# EAGLE design LineMixer  v1.1 (EAGLE 9.1.3)
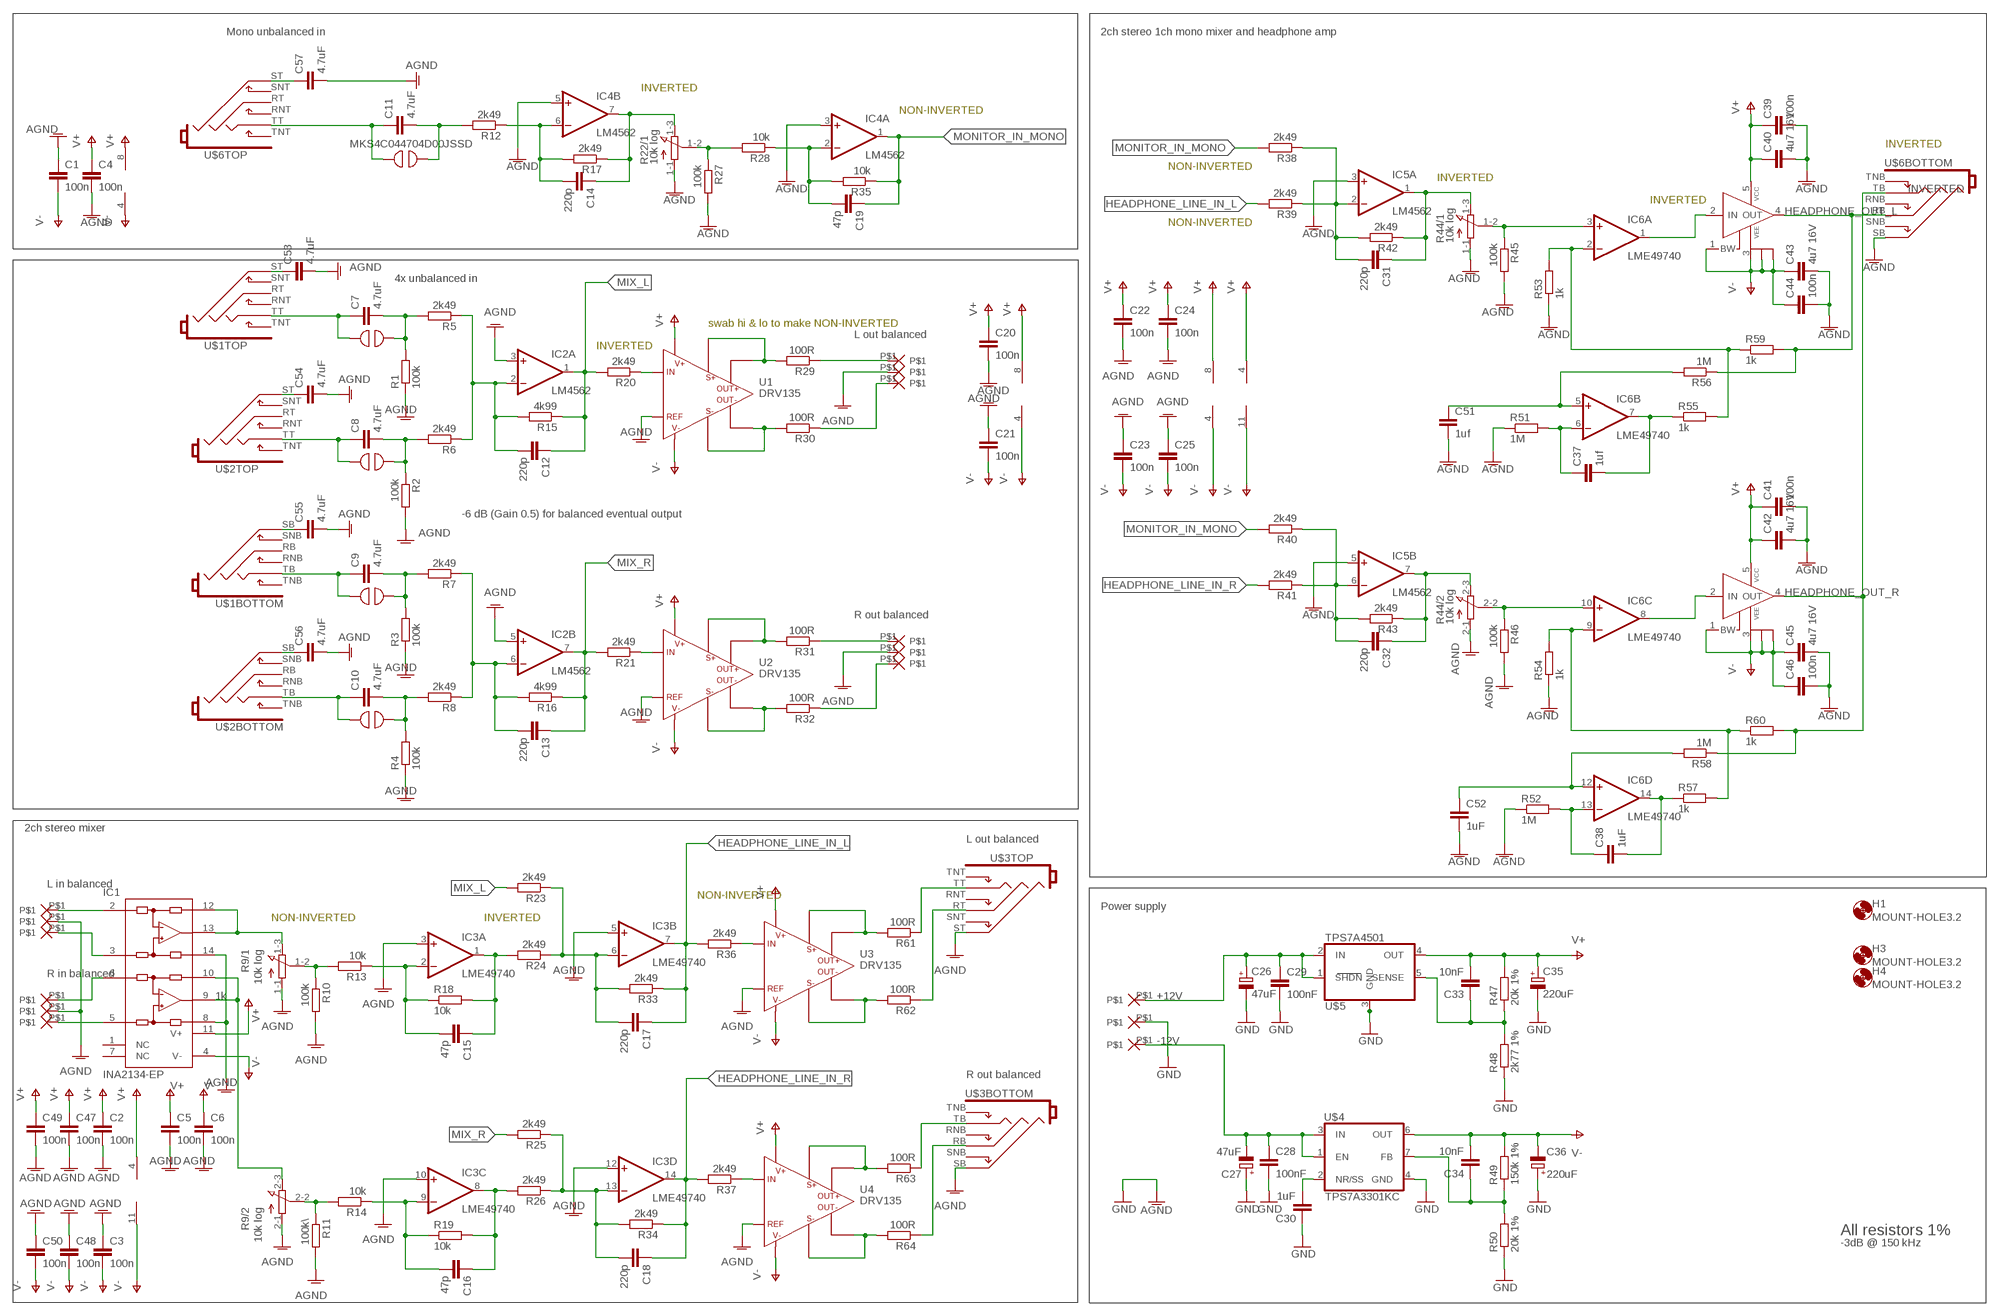
[diagram p0: schematic, sheet 1]

## Parts
C1  100n  C-EUC0603  [C0603]
C2  100n  C-EUC0603  [C0603]
C3  100n  C-EUC0603  [C0603]
C4  100n  C-EUC0603  [C0603]
C5  100n  C-EUC0603  [C0603]
C6  100n  C-EUC0603  [C0603]
C7  4.7uF  C15/7  [C15B7]
C8  4.7uF  C15/7  [C15B7]
C9  4.7uF  C15/7  [C15B7]
C10  4.7uF  C15/7  [C15B7]
C11  4.7uF  C15/7  [C15B7]
C12  220p  C-EUC0603K  [C0603K]
C13  220p  C-EUC0603K  [C0603K]
C14  220p  C-EUC0603K  [C0603K]
C15  47p  C-EUC0603K  [C0603K]
C16  47p  C-EUC0603K  [C0603K]
C17  220p  C-EUC0603K  [C0603K]
C18  220p  C-EUC0603K  [C0603K]
C19  47p  C-EUC0603K  [C0603K]
C20  100n  C-EUC0603  [C0603]
C21  100n  C-EUC0603  [C0603]
C22  100n  C-EUC0603  [C0603]
C23  100n  C-EUC0603  [C0603]
C24  100n  C-EUC0603  [C0603]
C25  100n  C-EUC0603  [C0603]
C26  47uF  CPOL-EUD/7343-31R  [D/7343-31R]
C27  47uF  CPOL-EUD/7343-31R  [D/7343-31R]
C28  100nF  C-EUC0603  [C0603]
C29  100nF  C-EUC0603  [C0603]
C30  1uF  C-EUC0603  [C0603]
C31  220p  C-EUC0603K  [C0603K]
C32  220p  C-EUC0603K  [C0603K]
C33  10nF  C-EUC0603  [C0603]
C34  10nF  C-EUC0603  [C0603]
C35  220uF  CPOL-EUD/7343-31R  [D/7343-31R]
C36  220uF  CPOL-EUD/7343-31R  [D/7343-31R]
C37  1uf  C-EUC0603  [C0603]
C38  1uF  C-EUC0603  [C0603]
C39  100n  C-EUC0603  [C0603]
C40  4u7 16V  C-EUC1206  [C1206]
C41  100n  C-EUC0603  [C0603]
C42  4u7 16V  C-EUC1206  [C1206]
C43  4u7 16V  C-EUC1206  [C1206]
C44  100n  C-EUC0603  [C0603]
C45  4u7 16V  C-EUC1206  [C1206]
C46  100n  C-EUC0603  [C0603]
C47  100n  C-EUC0603  [C0603]
C48  100n  C-EUC0603  [C0603]
C49  100n  C-EUC0603  [C0603]
C50  100n  C-EUC0603  [C0603]
C51  1uf  C-EUC0603  [C0603]
C52  1uF  C-EUC0603  [C0603]
C53  4.7uF  C15/7  [C15B7]
C54  4.7uF  C15/7  [C15B7]
C55  4.7uF  C15/7  [C15B7]
C56  4.7uF  C15/7  [C15B7]
C57  4.7uF  C15/7  [C15B7]
H1  MOUNT-HOLE3.2  [3,2]
H3  MOUNT-HOLE3.2  [3,2]
H4  MOUNT-HOLE3.2  [3,2]
IC1  INA2134-EP  INA2134U  [SO14]
IC2  LM4562  LM4558D  [SO08]
IC3  LME49740  TL074D  [SO14]
IC4  LM4562  LM4558D  [SO08]
IC5  LM4562  LM4558D  [SO08]
IC6  LME49740  TL074D  [SO14]
IC7  LME49600  [TS5B]
IC8  LME49600  [TS5B]
R1  100k  R-EU_0207/7  [0207/7]
R2  100k  R-EU_0207/7  [0207/7]
R3  100k  R-EU_0207/7  [0207/7]
R4  100k  R-EU_0207/7  [0207/7]
R5  2k49  R-EU_0207/7  [0207/7]
R6  2k49  R-EU_0207/7  [0207/7]
R7  2k49  R-EU_0207/7  [0207/7]
R8  2k49  R-EU_0207/7  [0207/7]
R9  10k log  3RP/1610G  [3RP/1610G]
R10  100k  R-EU_0207/7  [0207/7]
R11  100k\  R-EU_0207/7  [0207/7]
R12  2k49  R-EU_0207/7  [0207/7]
R13  10k  R-EU_0207/7  [0207/7]
R14  10k  R-EU_0207/7  [0207/7]
R15  4k99  R-EU_0207/7  [0207/7]
R16  4k99  R-EU_0207/7  [0207/7]
R17  2k49  R-EU_0207/7  [0207/7]
R18  10k  R-EU_0207/7  [0207/7]
R19  10k  R-EU_0207/7  [0207/7]
R20  2k49  R-EU_0207/7  [0207/7]
R21  2k49  R-EU_0207/7  [0207/7]
R22  10k log  3RP/1610G  [3RP/1610G]
R23  2k49  R-EU_0207/7  [0207/7]
R24  2k49  R-EU_0207/7  [0207/7]
R25  2k49  R-EU_0207/7  [0207/7]
R26  2k49  R-EU_0207/7  [0207/7]
R27  100k  R-EU_0207/7  [0207/7]
R28  10k  R-EU_0207/7  [0207/7]
R29  100R  R-EU_0207/7  [0207/7]
R30  100R  R-EU_0207/7  [0207/7]
R31  100R  R-EU_0207/7  [0207/7]
R32  100R  R-EU_0207/7  [0207/7]
R33  2k49  R-EU_0207/7  [0207/7]
R34  2k49  R-EU_0207/7  [0207/7]
R35  10k  R-EU_0207/7  [0207/7]
R36  2k49  R-EU_0207/7  [0207/7]
R37  2k49  R-EU_0207/7  [0207/7]
R38  2k49  R-EU_0207/7  [0207/7]
R39  2k49  R-EU_0207/7  [0207/7]
R40  2k49  R-EU_0207/7  [0207/7]
R41  2k49  R-EU_0207/7  [0207/7]
R42  2k49  R-EU_0207/7  [0207/7]
R43  2k49  R-EU_0207/7  [0207/7]
R44  10k log  3RP/1610G  [3RP/1610G]
R45  100k  R-EU_0207/7  [0207/7]
R46  100k  R-EU_0207/7  [0207/7]
R47  20k 1%  R-EU_R0603  [R0603]
R48  2k77 1%  R-EU_R0603  [R0603]
R49  150k 1%  R-EU_R0603  [R0603]
R50  20k 1%  R-EU_R0603  [R0603]
R51  1M  R-EU_0207/7  [0207/7]
R52  1M  R-EU_0207/7  [0207/7]
R53  1k  R-EU_0207/7  [0207/7]
R54  1k  R-EU_0207/7  [0207/7]
R55  1k  R-EU_0207/7  [0207/7]
R56  1M  R-EU_0207/7  [0207/7]
R57  1k  R-EU_0207/7  [0207/7]
R58  1M  R-EU_0207/7  [0207/7]
R59  1k  R-EU_0207/7  [0207/7]
R60  1k  R-EU_0207/7  [0207/7]
R61  100R  R-EU_0207/7  [0207/7]
R62  100R  R-EU_0207/7  [0207/7]
R63  100R  R-EU_0207/7  [0207/7]
R64  100R  R-EU_0207/7  [0207/7]
S1  SOLDERLINK  [SOLDERLINK]
S2  SOLDERLINK  [SOLDERLINK]
S3  SOLDERLINK  [SOLDERLINK]
S4  SOLDERLINK  [SOLDERLINK]
S5  SOLDERLINK  [SOLDERLINK]
U1  DRV135  DRV134SO-8  [SO-8]
U2  DRV135  DRV134SO-8  [SO-8]
U3  DRV135  DRV134SO-8  [SO-8]
U4  DRV135  DRV134SO-8  [SO-8]
U$1  NSJ12HF-1  [NSJ12HF-1]
U$2  NSJ12HF-1  [NSJ12HF-1]
U$3  NSJ12HF-1  [NSJ12HF-1]
U$4  TPS7A3301KC  [TO220-7]
U$5  TPS7A4501  [SOT223-5]
U$6  NSJ12HF-1  [NSJ12HF-1]
U$7  PAD1.5MM  [PAD_1.5MM]
U$8  PAD1.5MM  [PAD_1.5MM]
U$10  PAD1.5MM  [PAD_1.5MM]
U$11  PAD1.5MM  [PAD_1.5MM]
U$12  PAD1.5MM  [PAD_1.5MM]
U$13  PAD1.5MM  [PAD_1.5MM]
U$14  PAD1.5MM  [PAD_1.5MM]
U$15  PAD1.5MM  [PAD_1.5MM]
U$16  PAD1.5MM  [PAD_1.5MM]
U$17  PAD1.5MM  [PAD_1.5MM]
U$18  PAD1.5MM  [PAD_1.5MM]
U$19  PAD1.5MM  [PAD_1.5MM]
U$20  PAD1.5MM  [PAD_1.5MM]
U$21  PAD1.5MM  [PAD_1.5MM]
U$22  PAD1.5MM  [PAD_1.5MM]

## Nets
+12V: C26.+ C29.1 U$5.1(SHDN) U$5.2(IN) U$20.P$1
-12V: C27.- C28.1 U$4.1(EN) U$4.3(IN) U$22.P$1
AGND: C1.1 C2.2 C3.1 C4.2 C5.2 C6.2 C20.2 C21.1 C22.2 C23.1 C24.2 C25.1 C26.- C27.+ C28.2 C29.2 C30.1 C35.- C36.+ C39.2 C40.2 C41.2 C42.2 C43.2 C44.2 C45.2 C46.2 C47.2 C48.1 C49.2 C50.1 C51.2 C52.2 C53.2 C54.2 C55.2 C56.2 C57.2 IC1.8(REFB) IC1.14(REFA) IC2.3(A:+IN) IC2.5(B:+IN) IC3.3(A:+IN) IC3.5(B:+IN) IC3.10(C:+IN) IC3.12(D:+IN) IC4.3(A:+IN) IC4.5(B:+IN) IC5.3(A:+IN) IC5.5(B:+IN) R1.1 R2.2 R3.1 R4.1 R9.1-1(/1:A) R9.2-1(/2:A) R10.2 R11.2 R22.1-1(/1:A) R27.2 R44.1-1(/1:A) R44.2-1(/2:A) R45.2 R46.2 R48.1 R50.1 R51.1 R52.1 R53.1 R54.1 U1.P3(REF) U2.P3(REF) U3.P3(REF) U4.P3(REF) U$3.SB(BOTTOM:S) U$3.ST(TOP:S) U$4.4(GND) U$5.3(GND) U$5.TAB(GND) U$6.SB(BOTTOM:S) U$8.P$1 U$12.P$1 U$15.P$1 U$18.P$1 U$21.P$1 ; supply symbol labelled GND
HEADPHONE_LINE_IN_L: C17.1 IC3.7(B:OUT) R33.1 R36.2 R39.2
HEADPHONE_LINE_IN_R: C18.1 IC3.14(D:OUT) R34.1 R37.2 R41.2
HEADPHONE_OUT_L: IC7.4(OUT) R56.1 R59.2 U$6.RB(BOTTOM:R)
HEADPHONE_OUT_R: IC8.4(OUT) R58.1 R60.2 U$6.TB(BOTTOM:T)
MIX_L: C12.1 IC2.1(A:OUT) R15.1 R20.2 R23.2
MIX_R: C13.1 IC2.7(B:OUT) R16.1 R21.2 R25.2
MONITOR_IN_MONO: C19.1 IC4.1(A:OUT) R35.1 R38.2 R40.2
MONITOR_IN_MONO1: C14.1 IC4.7(B:OUT) R17.1 R22.1-3(/1:E)
N$1: R63.2 U4.P7(SENSE+) U4.P8(OUT+)
N$2: IC1.3(+INA) U$10.P$1
N$3: C9.2 R3.2 R7.2 S3.P$1
N$4: R61.2 U3.P7(SENSE+) U3.P8(OUT+)
N$5: C7.2 R1.2 R5.2 S1.P$1
N$6: C8.2 R2.1 R6.2 S2.P$1
N$7: C32.1 IC5.7(B:OUT) R43.1 R44.2-3(/2:E)
N$8: C15.2 IC3.2(A:-IN) R13.1 R18.1
N$9: C10.2 R4.2 R8.2 S4.P$1
N$10: IC1.12(SENSEA) IC1.13(OUTA) R9.1-3(/1:E)
N$11: R36.1 U3.P4(IN)
N$12: IC1.2(-INA) U$7.P$1
N$13: C32.2 IC5.6(B:-IN) R40.1 R41.1 R43.2
N$14: C16.2 IC3.9(C:-IN) R14.1 R19.1
N$15: R37.1 U4.P4(IN)
N$16: IC1.6(-INB) U$11.P$1
N$17: R62.1 U$3.RT(TOP:R)
N$18: IC1.5(+INB) U$13.P$1
N$19: R64.1 U$3.RB(BOTTOM:R)
N$20: IC1.9(OUTB) IC1.10(SENSEB) R9.2-3(/2:E)
N$21: C11.1 S5.P$2 U$6.TT(TOP:T)
N$22: C34.1 R49.1 R50.2 U$4.7(FB)
N$23: IC6.10(C:+IN) R44.2-2(/2:S) R46.1
N$24: C12.2 IC2.2(A:-IN) R5.1 R6.1 R15.2
N$25: R29.2 U1.P7(SENSE+) U1.P8(OUT+)
N$26: C15.1 IC3.1(A:OUT) R18.2 R24.2
N$27: C14.2 IC4.6(B:-IN) R12.1 R17.2
N$28: R20.1 U1.P4(IN)
N$29: C11.2 R12.2 S5.P$1
N$30: C18.2 IC3.13(D:-IN) R25.1 R26.1 R34.2
N$31: R30.1 U$19.P$1
N$32: R29.1 U$17.P$1
N$33: C31.1 IC5.1(A:OUT) R42.1 R44.1-3(/1:E)
N$34: R30.2 U1.P1(OUT-) U1.P2(SENSE-)
N$35: R21.1 U2.P4(IN)
N$36: C13.2 IC2.6(B:-IN) R7.1 R8.1 R16.2
N$37: C17.2 IC3.6(B:-IN) R23.1 R24.1 R33.2
N$38: R31.1 U$14.P$1
N$39: C31.2 IC5.2(A:-IN) R38.1 R39.1 R42.2
N$40: R32.1 U$16.P$1
N$41: R32.2 U2.P1(OUT-) U2.P2(SENSE-)
N$42: R31.2 U2.P7(SENSE+) U2.P8(OUT+)
N$43: IC6.3(A:+IN) R44.1-2(/1:S) R45.1
N$44: C16.1 IC3.8(C:OUT) R19.2 R26.2
N$45: IC6.2(A:-IN) R53.2 R55.2 R59.1
N$46: R61.1 U$3.TT(TOP:T)
N$47: R62.2 U3.P1(OUT-) U3.P2(SENSE-)
N$48: IC6.1(A:OUT) IC7.2(IN)
N$49: C37.1 IC6.6(B:-IN) R51.2
N$50: C37.2 IC6.7(B:OUT) R55.1
N$51: C51.1 IC6.5(B:+IN) R56.2
N$52: IC6.9(C:-IN) R54.2 R57.2 R60.1
N$53: IC6.8(C:OUT) IC8.2(IN)
N$54: R9.1-2(/1:S) R10.1 R13.2
N$55: C38.2 IC6.14(D:OUT) R57.1
N$56: C38.1 IC6.13(D:-IN) R52.2
N$57: R9.2-2(/2:S) R11.1 R14.2
N$58: C52.1 IC6.12(D:+IN) R58.2
N$59: C19.2 IC4.2(A:-IN) R28.1 R35.2
N$60: R22.1-2(/1:S) R27.1 R28.2
N$61: R63.1 U$3.TB(BOTTOM:T)
N$62: C30.2 U$4.2(NR/SS)
N$63: R64.2 U4.P1(OUT-) U4.P2(SENSE-)
N$64: C7.1 S1.P$2 U$1.TT(TOP:T)
N$65: C8.1 S2.P$2 U$2.TT(TOP:T)
N$66: C53.1 U$1.ST(TOP:S)
N$67: C57.1 U$6.ST(TOP:S)
N$68: C54.1 U$2.ST(TOP:S)
N$69: C9.1 S3.P$2 U$1.TB(BOTTOM:T)
N$70: C10.1 S4.P$2 U$2.TB(BOTTOM:T)
N$71: C55.1 U$1.SB(BOTTOM:S)
N$72: C56.1 U$2.SB(BOTTOM:S)
N$74: C33.1 R47.1 R48.2 U$5.5(SENSE)
V+: C2.1 C4.1 C5.1 C20.1 C22.1 C24.1 C33.2 C35.+ C39.1 C40.1 C41.1 C42.1 C47.1 C49.1 IC1.11(V+) IC2.8(P:V+) IC3.4(P:V+) IC4.8(P:V+) IC5.8(P:V+) IC6.4(P:V+) IC7.5(VCC) IC8.5(VCC) R47.2 U1.P6(V+) U2.P6(V+) U3.P6(V+) U4.P6(V+) U$5.4(OUT)
V-: C1.2 C3.2 C6.1 C21.2 C23.2 C25.2 C34.2 C36.- C43.1 C44.1 C45.1 C46.1 C48.2 C50.2 IC1.4(V-) IC2.4(P:V-) IC3.11(P:V-) IC4.4(P:V-) IC5.4(P:V-) IC6.11(P:V-) IC7.1(BW) IC7.3(VEE) IC7.TH@1(VEE) IC7.TH@2(VEE) IC8.1(BW) IC8.3(VEE) IC8.TH@1(VEE) IC8.TH@2(VEE) R49.2 U1.P5(V-) U2.P5(V-) U3.P5(V-) U4.P5(V-) U$4.6(OUT)
Unconnected: IC1.1(NC) IC1.7(NC) R22.2-1(/2:A) R22.2-2(/2:S) R22.2-3(/2:E) U$1.RB(BOTTOM:R) U$1.RNB(BOTTOM:RN) U$1.RNT(TOP:RN) U$1.RT(TOP:R) U$1.SNB(BOTTOM:SN) U$1.SNT(TOP:SN) U$1.TNB(BOTTOM:TN) U$1.TNT(TOP:TN) U$2.RB(BOTTOM:R) U$2.RNB(BOTTOM:RN) U$2.RNT(TOP:RN) U$2.RT(TOP:R) U$2.SNB(BOTTOM:SN) U$2.SNT(TOP:SN) U$2.TNB(BOTTOM:TN) U$2.TNT(TOP:TN) U$3.RNB(BOTTOM:RN) U$3.RNT(TOP:RN) U$3.SNB(BOTTOM:SN) U$3.SNT(TOP:SN) U$3.TNB(BOTTOM:TN) U$3.TNT(TOP:TN) U$6.RNB(BOTTOM:RN) U$6.RNT(TOP:RN) U$6.RT(TOP:R) U$6.SNB(BOTTOM:SN) U$6.SNT(TOP:SN) U$6.TNB(BOTTOM:TN) U$6.TNT(TOP:TN)

## Notes on the sheet
- Mono unbalanced in | 2ch stereo 1ch mono mixer and headphone amp
- INVERTED
- NON-INVERTED
- MKS4C044704D00JSSD | INVERTED
- NON-INVERTED
- INVERTED
- INVERTED
- INVERTED
- NON-INVERTED
- 4x unbalanced in
- swab hi & lo to make NON-INVERTED
- L out balanced
- INVERTED
- -6 dB (Gain 0.5) for balanced eventual output
- R out balanced
- 2ch stereo mixer
- L out balanced
- L in balanced
- NON-INVERTED
- Power supply
- NON-INVERTED | INVERTED
- R in balanced
- 1k
- R out balanced
- All resistors 1%
- -3dB @ 150 kHz

## Library data of the parts
C1-C6 C12-C25 C28-C34 C37-C52 = rcl:C-EU: CAPACITOR, European symbol
C7-C11 C53-C57 = capacitor-wima:C: CAPACITOR naming: grid - package width
C26 C27 C35 C36 = rcl:CPOL-EU: POLARIZED CAPACITOR, European symbol
H1 H3 H4 = holes:MOUNT-HOLE: MOUNTING HOLE with drill center marker
IC1 = burr-brown:INA2134: Audio Differential Line Receivers 0dB, G=1; MF: TEXAS INSTRUMENTS; MPN: INA2134UA; OC_FARNELL: 1212422; OC_NEWARK: 35C1748
IC2 IC4 IC5 = linear:*4558: OP AMP
IC3 IC6 = linear:TL074: OP AMP
IC7 IC8 = national-semiconductor:LME49600: High Performance, High Fidelity, High Current Audio Buffer Source: Data sheet <http://www.national.com/ds/LM/LME49600.pdf>
R1-R8 R10-R21 R23-R43 R45-R64 = rcl:R-EU_: RESISTOR, European symbol
R9 R22 R44 = pot:3RP/1610G: 16mm Potentiometer two level Source: http://www.alphapotentiometers.net/html/16mm_pot_2.html
S1-S5 = testpads:SOLDERLINK
U1-U4 = active:DRV134
U$1-U$3 U$6 = Neutrik:NSJ12HF-1: Stereo dual jack, full threaded nose The 1/4" stacking jack features highest board packing density as two jacks are in a single footprint and as they fit in 1 RU.
U$4 = TPS7A33:TPS7A33: Ultralow-Noise Negative Voltage Regulator v3
U$5 = TPS7A45xx:TPS7A4501: LOW-NOISE FAST-TRANSIENT-RESPONSE 1.5-A LOW-DROPOUT VOLTAGE REGULATOR
U$7 U$8 U$10-U$22 = PAD:PAD

## Board
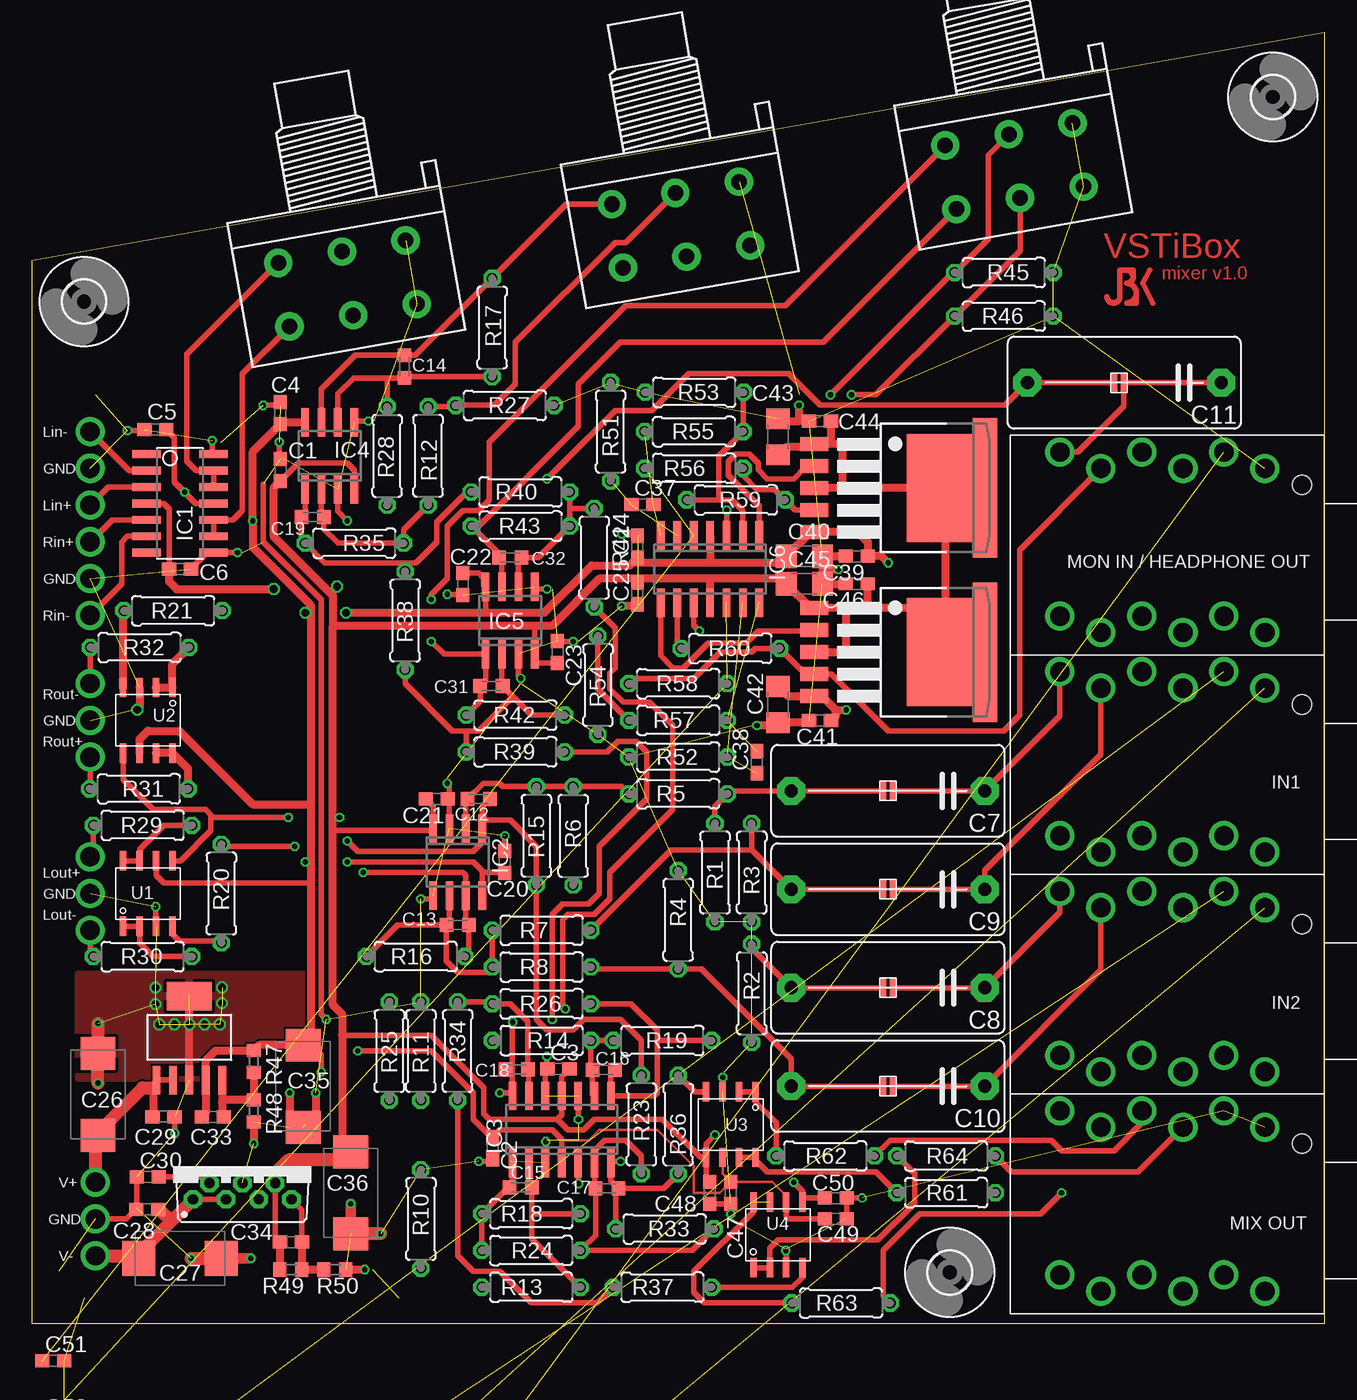
[diagram p1: board, top side]
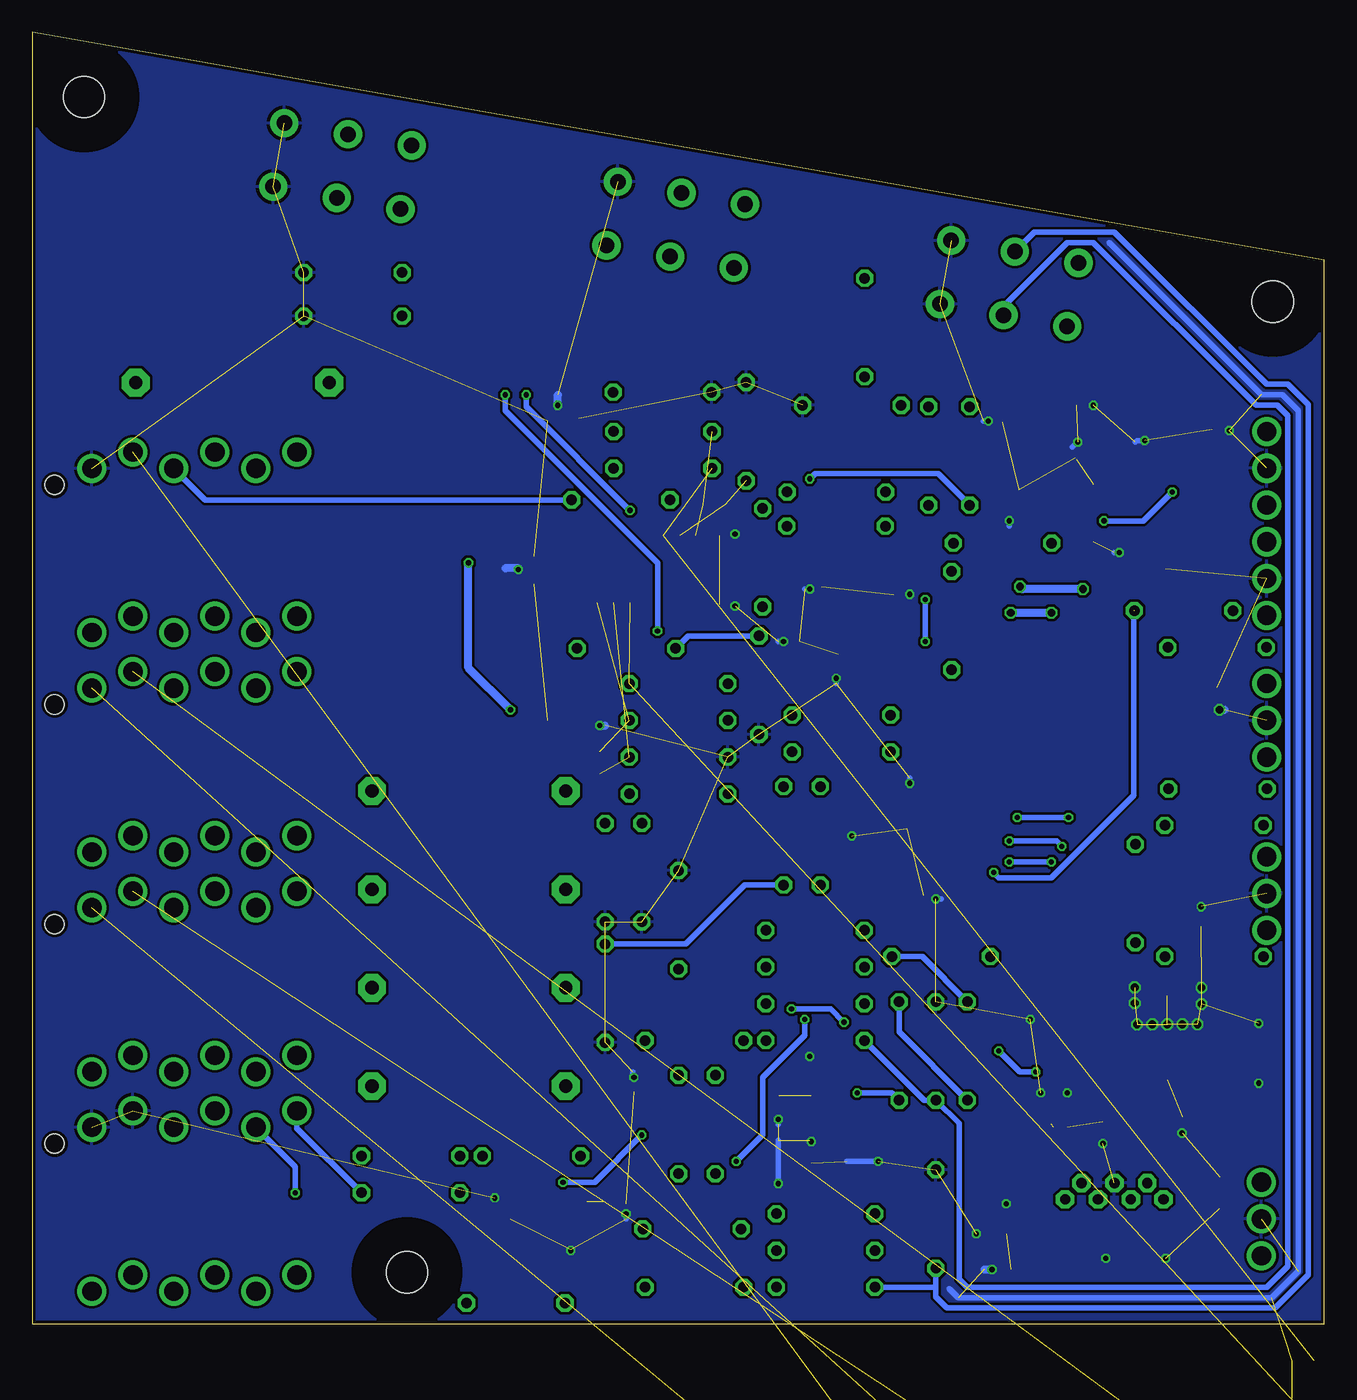
[diagram p2: board, bottom side, seen from below]

Size 100 x 100 mm. Coordinates in mm from the lower left corner, seen from the top.
Outline: 100,100 100,0 0,0 0,82.37 100,100
Copper layers (1*16): Top 0.035mm / dielectric 1.5mm / Bottom 0.035mm
Design rules "ITEADstudio_DRC *": minimum track width 6mil, minimum drill 12mil, track to track 6mil, track to pad 6mil, pad to pad 6mil, via to via 6mil, smd to smd 0mil, copper to edge 10mil, drill to drill 10mil, minimum pad ring 10mil, minimum via ring 6mil, stop-mask expansion 2mil, vias tented up to drill 100mil, thermal gap 10mil

### Footprints (pad centres in the part's own frame; a part is rotated, then mirrored left to right if it is on the bottom)
C0603 = smd 1.1 x 1: 1 -0.85,0; 2 0.85,0
C15B7 = drill 1.016 pad 2.159 octagon: 1 -7.493,0; 2 7.493,0
C0603K = smd 1.05 x 1.08: 1 -0.875,0; 2 0.875,0
D/7343-31R = smd 2.55 x 2.7: + 3.175,0; - -3.175,0
C1206 = smd 1.6 x 1.8: 1 -1.4,0; 2 1.4,0
3,2 = hole 3.2: 0,0
SO14 = smd 0.61 x 2.21: 1 -3.81,-2.603; 2 -2.54,-2.603; 3 -1.27,-2.603; 4 0,-2.603; 5 1.27,-2.603; 6 2.54,-2.603; 7 3.81,-2.603; 8 3.81,2.603; 9 2.54,2.603; 10 1.27,2.603; 11 0,2.603; 12 -1.27,2.603; 13 -2.54,2.603; 14 -3.81,2.603
SO08 = smd 0.6 x 2.2: 1 -1.905,-2.6; 2 -0.635,-2.6; 3 0.635,-2.6; 4 1.905,-2.6; 5 1.905,2.6; 6 0.635,2.6; 7 -0.635,2.6; 8 -1.905,2.6
SO14' = smd 0.6 x 2.2: 1 -3.81,-2.6; 2 -2.54,-2.6; 3 -1.27,-2.6; 4 0,-2.6; 5 1.27,-2.6; 6 2.54,-2.6; 7 3.81,-2.6; 8 3.81,2.6; 9 2.54,2.6; 10 1.27,2.6; 11 0,2.6; 12 -1.27,2.6; 13 -2.54,2.6; 14 -3.81,2.6
TS5B = smd 1.07 x 2.16: 1 -3.4,-6.55; 2 -1.7,-6.55; 3 0,-6.55; 4 1.7,-6.55; 5 3.4,-6.55 | smd 10.8 x 1.91: TH@1 0,6.665 | smd 8.33 x 6: TH@2 0,3.635
0207/7 = drill 0.813 octagon: 1 -3.81,0; 2 3.81,0
3RP/1610G = drill 1.2 pad 2.184: 1-1 -5,0; 1-2 0,0; 1-3 5,0; 2-1 -5,5; 2-2 0,5; 2-3 5,5
R0603 = smd 1 x 1.1: 1 -0.85,0; 2 0.85,0
SOLDERLINK = smd 0.5 x 1.5: P$1 -0.375,0; P$2 0.375,0
SO-8 = smd 0.5 x 1.5: P1 -1.905,-2.54; P2 -0.635,-2.54; P3 0.635,-2.54; P4 1.905,-2.54; P5 1.905,2.54; P6 0.635,2.54; P7 -0.635,2.54; P8 -1.905,2.54
NSJ12HF-1 = drill 1.5: RB -10.95,7.23; RNB -10.95,-5.47; RNT -14.13,-4.2; RT -14.13,8.5; SB -4.606,7.23; SNB -4.606,-5.47; SNT -7.78,-4.2; ST -7.78,8.5; TB -17.3,7.23; TNB -17.3,-5.47; TNT -20.48,-4.2; TT -20.48,8.5 | hole 1.5: -1.73,5.96
TO220-7 = drill 0.8 pad 1.422 octagon: 1 -3.81,-2.54; 2 -2.54,-1.27; 3 -1.27,-2.54; 4 0,-1.27; 5 1.27,-2.54; 6 2.54,-1.27; 7 3.81,-2.54
SOT223-5 = smd 0.6 x 2.2: 1 -2.54,-3.5; 2 -1.27,-3.5; 3 0,-3.5; 4 1.27,-3.5; 5 2.54,-3.5 | smd 3.5 x 2.2: TAB 0,3
PAD_1.5MM = drill 1.5 pad 2.1: P$1 0,0

### Placement (x,y rotation side)
C1  19.2,66.12 270 top
C2  35.64,13.61 270 top
C3  40.72,19.74 0 top
C4  19.2,70.51 90 top
C5  9.53,69.24 180 top
C6  11.43,58.45 0 top
C7  66.22,41.27 180 top
C8  66.22,26.04 180 top
C9  66.22,33.66 180 top
C10  66.22,18.41 180 top
C11  84.51,72.87 180 top
C12  34.54,40.64 180 top
C13  32.92,30.89 180 top
C14  28.8,74.12 270 top
C15  37.8,10.57 0 top
C16  44.22,19.68 180 top
C17  44.48,10.52 180 top
C18  37.49,19.71 0 top
C19  21.69,62.46 0 top
C20  36.58,35.76 90 top
C21  31.29,40.64 180 top
C22  33.32,57.28 270 top
C23  40.64,52.02 270 top
C24  46.84,60.17 90 top
C25  46.84,56.57 90 top
C26  5.08,17.78 270 top
C27  11.43,5.08 0 top
C28  8.89,8.89 180 top
C29  10.16,16.05 0 top
C30  8.94,11.38 0 top
C31  35.53,49.4 0 top
C32  36.98,59.33 0 top
C33  13.97,16.05 180 top
C34  20.02,6.35 180 top
C35  20.95,18.41 90 top
C36  24.64,10.16 270 top
C37  47.22,63.45 0 top
C38  56.08,43.48 90 top
C39  63.8,59.44 180 top
C40  59.74,59.44 0 top
C41  60.96,46.74 180 top
C42  57.71,47.96 270 top
C43  57.71,68.68 90 top
C44  60.96,69.9 180 top
C45  59.74,57.3 0 top
C46  63.8,57.3 180 top
C47  54.05,10.16 270 top
C48  52.43,10.16 90 top
C49  62.18,8.13 0 top
C50  62.18,9.75 180 top
C51  1.63,-2.84 0 top
C52  1.63,-7.72 0 top  (outside the outline)
C53  9.35,-16.26 0 top  (outside the outline)
C54  9.35,-26.01 0 top  (outside the outline)
C55  9.35,-35.76 0 top  (outside the outline)
C56  9.35,-45.52 0 top  (outside the outline)
C57  9.35,-55.27 0 top  (outside the outline)
H1  96,95 0 top
H3  71,4 0 top
H4  4,79.15 0 top
IC1  11.43,63.53 270 top
IC2  32.92,35.76 180 top
IC3  LME49740  [SO14']  40.97,15.06 0 top
IC4  23.01,67.21 0 top
IC5  36.98,54.46 0 top
IC6  LME49740  [SO14']  52.45,58.45 180 top
IC7  67.06,64.72 270 top
IC8  67.06,52.02 270 top
R1  52.83,34.95 90 top
R2  55.68,25.6 270 top
R3  55.68,34.95 90 top
R4  49.99,31.29 270 top
R5  49.99,41.05 0 top
R6  41.86,37.8 270 top
R7  39.42,30.48 0 top
R8  39.42,27.64 0 top
R9  23.97,83.02 190 top
R10  30.07,8.13 90 top
R11  30.07,21.13 90 top
R12  27.46,67.21 270 top
R13  38.61,2.84 180 top
R14  39.42,21.95 180 top
R15  39.01,37.8 90 top
R16  29.67,28.45 180 top
R17  35.59,77.14 270 top
R18  38.61,8.53 180 top
R19  48.77,21.95 0 top
R20  14.63,33.32 90 top
R21  10.9,55.22 0 top
R22  49.77,87.56 190 top
R23  47.14,15.44 90 top
R24  38.61,5.69 180 top
R25  27.64,21.13 90 top
R26  39.42,24.79 0 top
R27  36.58,71.12 0 top
R28  30.63,67.21 90 top
R29  8.53,38.61 0 top
R30  8.53,28.45 0 top
R31  8.26,41.43 0 top
R32  8.31,52.37 0 top
R33  48.95,7.37 0 top
R34  32.92,21.13 90 top
R35  24.92,60.45 0 top
R36  49.99,15.44 270 top
R37  48.77,2.84 180 top
R38  28.85,54.46 90 top
R39  37.39,44.3 0 top
R40  37.77,64.41 180 top
R41  43.48,59.33 270 top
R42  37.39,47.14 0 top
R43  37.8,61.77 0 top
R44  75.57,92.1 190 top
R45  75.18,81.41 0 top
R46  75.18,78.03 0 top
R47  17.14,20.32 90 top
R48  17.14,16.51 90 top
R49  20.02,4.22 180 top
R50  23.42,4.22 180 top
R51  44.75,69.09 270 top
R52  49.99,43.89 0 top
R53  51.23,72.14 0 top
R54  43.76,49.45 90 top
R55  51.21,69.09 0 top
R56  51.21,66.24 180 top
R57  49.99,46.74 180 top
R58  49.99,49.58 0 top
R59  54.46,63.8 0 top
R60  54.03,52.3 0 top
R61  70.71,10.16 180 top
R62  61.37,13 180 top
R63  62.59,1.63 180 top
R64  70.71,13 180 top
S1  66.22,41.27 0 top
S2  66.22,26.04 0 top
S3  66.22,33.66 0 top
S4  66.22,18.41 0 top
S5  84.1,72.87 0 top
U1  8.94,33.32 0 top
U2  8.94,46.74 180 top
U3  54.05,15.44 180 top
U4  57.71,6.91 0 top
U$1  100,42 0 top
U$2  100,25 0 top
U$3  100,8 0 top
U$4  16.26,12.19 0 top
U$5  12.15,22.39 0 top
U$6  100,59 0 top
U$7  4.47,69.09 0 top
U$8  4.47,66.24 0 top
U$9  [JBK_LOGO_SMALL_COPPER]  82.91,79.04 0 top
U$10  4.47,63.4 0 top
U$11  4.47,54.86 0 top
U$12  4.47,57.71 0 top
U$13  4.47,60.55 0 top
U$14  4.47,43.89 0 top
U$15  4.47,46.74 0 top
U$16  4.47,49.58 0 top
U$17  4.47,36.17 0 top
U$18  4.47,33.32 0 top
U$19  4.47,30.48 0 top
U$20  4.88,10.97 0 top
U$21  4.88,8.13 0 top
U$22  4.88,5.28 0 top

### Tracks (layer width: path | path; a pad name or v marks a point on that pad's centre or on a via)
+12V
  Top 0.406: U$5.2 U$5.1 9.61,18.29
  Top 0.61: 9.61,18.29 9.35,18.29 9.35,16.05 C29.1
  Top 1.016: 9.35,18.29 8.53,18.29 5.33,15.08 5.33,14.61 C26.+ 4.62,14.15 4.88,13.89 U$20.P$1
-12V
  Top 0.406: U$4.1 U$4.3
  Top 1.016: 10.74,7.95 8.51,5.71 8.26,5.71 C27.- 8.05,5.28 U$22.P$1 | 10.74,7.95 U$4.1 | C28.1 9.8,8.89 10.74,7.95
AGND  (via drill 0.4, 0.6)  (83 unrouted)
  Top 0.406: C29.2 11.02,16.04 v11.02,14.78 | 8.64,69.28 C5.2 8.6,69.16 v7.37,69.16 | IC1.14 13.92,67.45 v13.92,68.4 | v15.88,59.72 IC1.8 13.55,59.72 C6.2 | IC4.5 25.01,69.9 v26.01,69.9 | IC4.3 23.65,62.92 v24.38,62.18 | C30.1 8.09,8.94 C28.2 7.28,8.13 U$21.P$1 | C1.1 19.29,67.06 19.1,67.06 v19.1,68.28 | v17.88,71.12 19.2,71.12 C4.2 | C22.2 33.33,56.49 v32.11,56.49 | C23.1 40.64,52.83 v41.86,52.83 | IC5.5 39.05,56.9 v39.83,56.9 | IC5.3 37.62,50.16 v37.8,49.99 | C21.1 32.28,40.5 IC2.3 32.28,41.86 v32.11,41.86 | IC2.5 31.01,32.92 v30.07,32.92 | C20.2 v36.58,37.8 | IC3.10 42.24,15.85 v42.27,15.85 | C2.2 35.47,12.6 v34.54,12.6 | 39.7,19.74 C3.1 | IC3.12 39.7,19.57 C3.1 | v39.83,20.73 39.83,19.77 C3.1 | v39.73,14.12 39.73,12.49 IC3.3 | v42.27,10.87 42.27,12.49 IC3.5 | U1.P3 9.55,30.79 v9.55,32.31 | v22.76,23.57 22.35,23.98 22.35,56.08 17.88,60.55 17.88,65.02 | v54.05,8.53 C47.2 C48.1 | U4.P3 58.34,5.51 58.32,5.54 v58.32,5.69 | C49.2 C50.1 v64.21,9.75 | U3.P3 53.44,18.01 v53.44,19.1
  Top 0.61: R48.1 v17.14,13.97 | R50.1 v25.73,4.22 | U$5.3 U$5.TAB | U2.P3 8.31,47.73 v8.13,47.55 | v19.91,17.88 19.91,15.24 C35.- | v21.95,17.88 21.95,15.44 21.13,15.44 | v56.08,46.33 57.48,46.33 C42.2 59.93,46.55 C41.2 | C40.2 C39.2 | C40.2 C45.2 C46.2 | C40.2 61.14,58.42 v62.38,58.42 | C24.2 46.84,61.16 v45.62,61.16 | C25.1 46.84,55.58 v45.62,55.58 | C43.2 57.71,69.9 59.33,69.9 | C44.2 59.33,69.9 | 59.33,69.9 v59.33,71.12
  Top 0.813: C27.+ v16.92,5.08 | C36.+ v24.64,9.3
  Top 1.016: v5.08,23.27 C26.- v5.08,18.64 | v26.95,6.99 C36.+ | v12.29,5.08 C27.+
  Bottom 0.406: v26.01,69.9 26.42,69.9 | v24.38,62.18 24.38,61.77 | v13.92,68.4 14.5,68.4 14.63,68.28 | v15.88,59.72 16.26,59.72 | v19.1,68.28 19.51,67.87 | v41.86,52.83 42.27,52.83 | v39.83,56.9 40.23,56.9 | v37.8,49.99 37.8,49.58 | v30.07,32.92 29.67,32.92 | v32.11,41.86 32.11,42.27 | v42.27,15.85 42.27,15.44 | v39.73,14.12 39.83,14.22 | v42.27,10.87 42.27,14.22 | v34.54,12.6 36.98,12.6 | 29.06,2.74 28.35,2.03 4.06,2.03 2.03,4.06 2.03,70.71 3.25,71.93 4.88,71.93 16.66,83.72 | v54.05,8.53 54.05,8.13 | v58.32,5.69 58.32,5.79 | v53.44,19.1 53.54,19.2 53.54,19.51
  Bottom 0.61: 26.31,4.22 v25.73,4.22 | v8.13,47.55 7.72,47.55 | v56.08,46.33 55.68,46.33 | v62.38,58.42 62.38,58.52 63.4,58.52 | v59.33,71.12 59.33,71.93
  other vias: 9.53,26.04 9.53,24.77 14.68,26.06 14.68,24.84 9.83,23.19 11,23.19 12.17,23.19 13.34,23.19 14.5,23.19
  pour Bottom (isolate 0.203): 0,0 100,0 100,99.88 0,82.12
  pour Top: 3.61,27.08 20.93,27.08 20.93,19.05 3.61,19.05
HEADPHONE_LINE_IN_L  (via drill 0.4)
  Top 0.406: v40.23,23.57 40.23,31.7 41.05,32.51 43.08,32.51 43.89,33.33 43.89,36.98 47.55,40.64 47.55,44.3 46.74,45.11 45.31,45.11 44.5,44.3 R39.2 | IC3.7 44.7,12.54 | IC3.7 44.78,11.09 C17.1 | R33.1 45.14,10.3 C17.1 | C17.1 48.87,10.52 R36.2 | v45.52,12.6 44.92,12.6 IC3.7
  Bottom 0.406: v45.52,12.6 43.48,14.63 43.48,19.1 40.23,22.35 v40.23,23.57
HEADPHONE_LINE_IN_R  (via drill 0.4)
  Top 0.406: R41.2 45.11,53.9 45.11,50.8 44.7,50.39 44.7,49.17 45.72,48.16 47.75,48.16 49.58,46.33 49.58,39.83 44.7,34.95 44.7,32.92 43.48,31.7 41.45,31.7 41.05,31.29 41.05,24.38 v41.25,24.38 | v37.19,23.37 37.16,23.34 IC3.14 | IC3.14 37.16,19.17 C18.1 | R37.2 43.74,1.63 38.61,1.63 36.17,4.06 34.14,4.06 32.92,5.28 R34.1 | v36.17,17.88 36.94,17.88 IC3.14
  Bottom 0.406: v41.25,24.38 38.2,24.38 v37.19,23.37 | v36.17,17.88 33.48,17.88 R34.1
HEADPHONE_OUT_L
  Top 0.406: IC7.4 59.05,63.02 R59.2 57.45,64.62 56.08,64.62 55.02,65.68 R56.1
  Bottom 0.406: U$6.RB 86.62,63.8 R59.2
HEADPHONE_OUT_R
  Top 0.406: R58.1 46.58,49.99 51.21,49.99 53.24,52.02 55.68,52.02 55.96,52.3 R60.2 59.74,50.39 60.43,50.39 IC8.4 61.85,50.32 66.24,45.92 75.18,45.92 76.4,47.14 76.4,59.93 U$6.TB
MIX_L  (via drill 0.4)
  Top 0.406: 34.82,39.01 IC2.1 34.82,37.26 34.14,36.58 25.2,36.58 v24.38,37.39 | 34.82,39.01 34.82,40.04 C12.1 | 34.82,39.01 36.98,39.01 39.01,36.98 R15.1 39.01,23.57 39.83,22.76 41.86,22.76 42.67,23.57 45.52,23.57 47.14,21.95 R23.2 | R20.2 14.63,36.98 v20.32,36.98
  Bottom 0.406: v20.32,36.98 20.73,37.39 v24.38,37.39
MIX_R  (via drill 0.4)  (1 unrouted)
  Top 0.406: R16.1 33.79,28.76 C13.1 33.55,31.05 IC2.7 33.55,34.72 33.33,34.95 v25.6,34.95
  Bottom 0.406: R16.1 31.14,28.45 R25.2 | 14.76,55.27 14.76,40.92 21.13,34.54 25.2,34.54 v25.6,34.95
MONITOR_IN_MONO
  Top 0.406: IC4.1 21.11,62.75 C19.1 20.82,60.74 R35.1 22.63,58.93 28.85,58.93 | 28.85,58.93 29.69,58.93 31.29,60.53 31.29,62.08 33.63,64.41 R40.2 | R38.2 28.85,58.93
MONITOR_IN_MONO1
  Top 0.406: IC4.7 22.38,72.36 25,74.99 C14.1 29.63,74.99 R17.1 41.33,86.69 R22.1-3
N$1  (1 unrouted)
  Top 0.406: R63.2 52.02,1.63 51.21,2.44 51.21,4.06 55.8,8.66 U4.P8
N$2
  Top 0.406: IC1.3 5.87,64.8 U$10.P$1
N$3
  Top 0.406: S3.P$1 C9.2 55.68,36.7 | 55.68,36.7 R3.2 | R7.2 49.45,36.7 55.68,36.7
N$4
  Top 0.406: U3.P7 U3.P8 55.96,12.72 56.9,11.79 65.28,11.79 R61.2
N$5
  Top 0.406: S1.P$1 C7.2 54.03,41.27 R5.2 52.83,40.08 R1.2
N$6
  Top 0.406: S2.P$1 C8.2 55.68,29.08 R2.1
  Bottom 0.406: R6.2 44.86,33.98 49.43,29.41 R2.1
N$7
  Top 0.406: IC5.7 36.35,59.09 C32.1 36.11,59.65 R43.1 34.54,61.77 42.27,69.49 42.27,72.75 45.52,76 61.2,76 R44.2-3
N$8
  Top 0.406: R13.1 38.67,6.59 38.67,8.53 | 38.67,8.53 C15.2 38.43,10.81 IC3.2 | R18.1 38.67,8.53
N$9
  Top 0.406: S4.P$1 C10.2 58.73,20.52 51.77,27.48 R4.2 43.38,27.48 R8.2
N$10
  Top 0.406: IC1.12 IC1.13 12.7,66.06 11.96,66.8 11.96,75.07 R9.1-3
N$11
  Top 0.406: R36.1 51.26,17.98 U3.P4
N$12
  Top 0.406: IC1.2 7.49,66.06 U$7.P$1
N$13
  Top 0.406: IC5.6 37.62,59.09 C32.2 39.17,59.33 R43.2 41.6,63.14 | 41.6,64.44 R40.1 41.6,64.39 41.6,63.4 41.6,63.14 | R41.1 41.6,63.14
N$14
  Top 0.406: IC3.9 43.35,17.83 C16.2 43.23,19.8 R14.1 R19.1
N$15
  Top 0.406: R37.1 58.83,2.85 59.61,3.63 U4.P4
N$16
  Top 0.406: IC1.6 7.34,60.98 6.91,60.55 6.91,57.3 U$11.P$1
N$17
  Top 0.406: R62.1 66.4,14.22 78.84,14.22 79.65,13.41 83.72,13.41 85.87,15.56 U$3.RT
N$18
  Top 0.406: IC1.5 6.17,62.26 U$13.P$1
N$19
  Top 0.406: U$3.RB 85.61,11.79 75.74,11.79 R64.1
N$20
  Top 0.406: IC1.9 IC1.10 15.52,62.26 16.26,62.99 16.26,73.57 R9.2-3
N$21
  Top 0.406: C11.1 S5.P$2 84.47,71.06 80.91,67.5 U$6.TT
N$22
  Top 0.406: U$4.7 20.86,8.85 C34.1
  Top 0.61: C34.1 R49.1 R50.2
N$23  (via drill 0.4)
  Top 0.406: IC6.10 51.18,54.08 v51.61,53.65 | v63.4,71.93 65.28,71.93 R46.1 76.44,83.09 R44.2-2
  Bottom 0.406: v51.61,53.65 51.61,58.93 63.4,70.71 v63.4,71.93
N$24
  Top 0.406: IC2.2 33.55,40.52 C12.2 34.89,41.86 36.17,41.86 36.42,41.6 R15.2 R6.1 45.62,41.6 R5.1
N$25
  Top 0.406: R29.2 10.16,38.61 8.31,36.75 U1.P7 U1.P8
N$26
  Top 0.406: R24.2 R18.2 36.83,10.57 C15.1 37.16,10.81 IC3.1
N$27
  Top 0.406: R17.2 28.89,73.33 C14.2 27.46,73.24 | IC4.6 23.65,72.01 24.88,73.24 27.46,73.24 | R12.1 27.46,73.24
N$28
  Top 0.406: R20.1 14.48,29.67 11.38,29.67 10.85,30.2 U1.P4
N$29  (via drill 0.4)
  Top 0.406: 83.72,72.75 S5.P$1 C11.2 75.26,71.12 60.96,71.12 58.52,73.56 50.8,73.56 47.95,70.71 45.11,70.71 v39.83,65.43
  Bottom 0.406: v39.83,65.43 39.42,65.84 29.9,65.84 R12.2
N$30
  Top 0.406: IC3.13 38.43,19.65 C18.2 38.33,19.75 38.33,23.44 36.98,24.79 R26.1 35.46,24.94 R34.2
  Bottom 0.406: R34.2 32.92,22.61 R25.1
N$31
  Top 0.406: U$19.P$1 4.47,28.7 R30.1
N$32
  Top 0.406: R29.1 4.72,36.42 U$17.P$1
N$33  (via drill 0.4)
  Top 0.406: R42.1 34.66,48.22 C31.1 35.08,49.82 IC5.1 31.86,51.86 v30.89,52.83 | v30.89,56.08 30.89,56.49 32.11,57.71 32.11,61.77 33.33,62.99 34.54,62.99 35.36,63.8 35.36,68.28 45.92,78.84 58.25,78.84 R44.1-3
  Bottom 0.406: v30.89,56.08 v30.89,52.83
N$34
  Top 0.406: U1.P1 U1.P2 8.31,29.49 9.35,28.45 R30.2
N$35
  Top 0.61: U2.P4 7.04,55.22 R21.1
N$36
  Top 0.406: IC2.6 32.28,31.13 C13.2 | C13.2 28.3,30.89 R16.2 | R7.1 R8.1 35.2,27.23 32.92,27.23 32.04,28.1 C13.2
N$37
  Top 0.406: R23.1 47.14,13.01 45.92,14.22 44.3,14.22 43.48,13.41 43.48,12.49 IC3.6 43.51,10.61 C17.2 43.6,6.87 R24.1 51.08,5.69 R33.2
N$38
  Top 0.406: U$14.P$1 4.47,41.45 R31.1
N$39
  Top 0.406: IC5.2 36.35,49.47 C31.2 36.41,49.34 37.19,48.56 | 37.19,48.56 38.61,47.14 R42.2 | R38.1 28.85,49.58 32.51,45.92 33.58,45.92 | 33.58,45.92 34.54,45.92 37.19,48.56 | R39.1 33.58,45.92
N$40
  Top 0.406: R32.1 4.5,49.61 U$16.P$1
N$41
  Top 0.61: U2.P2 U2.P1 10.85,51.1 R32.2
N$42
  Top 0.61: R31.2 12.06,42.98 U2.P8 U2.P7
N$43  (via drill 0.4)
  Top 0.406: IC6.3 53.75,61.05 v53.75,62.99 | v61.77,71.93 71.25,81.41 R45.1 73.97,84 73.97,90.5 R44.1-2
  Bottom 0.406: v53.75,62.99 61.77,71.02 v61.77,71.93
N$44
  Top 0.406: C16.1 44.78,19.37 IC3.8 48.14,17.66 48.36,17.88 48.36,21.95 | R26.2 46.33,24.79 48.36,22.76 48.36,21.95 | R19.2 48.36,21.95
N$45
  Top 0.406: R59.1 53.14,63.8 | 53.14,63.8 54.15,63.8 54.99,62.97 IC6.2 | 53.14,63.8 53.14,67.21 R55.2 55.02,72.11 R53.2
N$46
  Bottom 0.406: R61.1 79.52,15.16 U$3.TT
N$47
  Top 0.406: U3.P2 U3.P1 55.96,17.2 57.56,15.6 R62.2
N$48
  Top 0.406: IC7.2 60.33,66.24 59.74,66.24 58.93,65.43 56.9,65.43 56.19,66.14 56.19,66.65 55.47,67.36 54.46,67.36 53.85,66.75 53.85,65.73 56.26,63.32 IC6.1
N$49  (2 unrouted)
N$50  (2 unrouted)
N$51  (2 unrouted)
N$52
  Top 0.406: IC6.9 49.91,52.6 R60.1 | R57.2 43.76,49.15 R54.2
  Bottom 0.406: R54.2 49.25,53.26 R60.1
N$53
  Top 0.406: IC8.2 60.43,53.65 56.19,53.65 55.27,52.73 52.32,52.73 50.39,50.8 49.58,50.8 48.64,51.74 IC6.8
N$54
  Bottom 0.406: 30.07,2.85 30.07,2.11 29.23,1.27 3.81,1.27 1.27,3.81 1.27,71.17 2.85,72.75 4.47,72.75 16.26,84.53 22.45,84.53 R9.1-2 | 30.07,2.85 R10.1 | R13.2 30.07,2.85
N$55  (2 unrouted)
N$56  (2 unrouted)
N$57
  Bottom 0.406: R14.2 30.99,17.32 R11.1 28.27,15.52 28.27,3.45 27.66,2.85 4.47,2.85 2.85,4.47 2.85,70.31 3.66,71.12 5.28,71.12 17.88,83.72 19.91,83.72 24.83,78.8 R9.2-2
N$58  (2 unrouted)
N$59
  Top 0.406: IC4.2 22.38,62.65 C19.2 22.57,61.56 23.67,60.45 R35.2 28.73,61.49 R28.1
N$60
  Top 0.406: R28.2 32.66,71.02 R27.1 35.76,71.12 37.39,72.75 37.39,76 45.11,83.72 45.92,83.72 R22.1-2
N$61  (via drill 0.4)
  Top 0.406: R63.1 65.84,2.18 65.84,5.69 68.68,8.53 78.03,8.53 v79.65,10.16
  Bottom 0.406: v79.65,10.16 79.65,12.18 U$3.TB
N$62
  Top 0.406: C30.2 13.26,11.38 U$4.2
N$63
  Top 0.406: U4.P1 U4.P2 57.07,5.87 57.71,6.5 65.43,6.5 68.28,9.35 68.28,11.63 R64.2
N$64
  Top 0.406: S1.P$2 C7.1 79.52,47.08 U$1.TT
N$65
  Top 0.406: S2.P$2 C8.1 79.52,31.84 U$2.TT
N$66  (1 unrouted)
N$67  (1 unrouted)
N$68  (1 unrouted)
N$69
  Top 0.406: S3.P$2 C9.1 73.71,35.1 82.7,44.09 U$1.TB
N$70
  Top 0.406: S4.P$2 C10.1 82.7,27.4 U$2.TB
N$71  (1 unrouted)
N$72  (1 unrouted)
N$74
  Top 0.61: U$5.5 14.69,17.14 | 14.69,17.14 14.69,16.18 C33.1 | 14.69,17.14 14.9,17.36 R48.2 R47.1
V+  (via drill 0.4, 0.6)
  Top 0.203: 40.97,14.22 43.08,14.22 43.89,15.04 48.36,15.04 51.21,12.19 51.21,10.16 53.2,10.16 C47.1 | U3.P6 53.42,11.64 C47.1 | U4.P6 58.34,9.93 57.27,11.01 C47.1
  Top 0.406: C5.1 11,68.62 11,65.18 11.27,64.91 | 11.27,64.91 12.65,63.52 IC1.11 | 34.95,55.07 35.08,55.07 IC5.8 34.95,57.19 34.95,57.71 34.53,58.13 C22.1 | U1.P6 9.58,34.72 10.16,34.14 21.54,34.14 | v24.38,35.76 34.14,35.76 34.82,35.08 34.82,34.95 | v21.13,35.76 21.54,35.76 | 34.82,34.95 IC2.8 | C20.1 36.54,34.95 34.82,34.95 | 21.59,21.59 22.35,20.83 v22.35,19.51 | v25.2,21.13 30.89,21.13 34.14,17.88 34.14,15.85 35.52,14.46 C2.1 35.64,14.5 36.17,15.04 40.23,15.04 40.97,14.3 IC3.4 40.97,14.22 | v11.79,64.41 11.29,64.91 11.27,64.91 | U4.P6 58.34,8.31 58.52,8.13 C49.1
  Top 0.61: C33.2 13.42,16.35 U$5.4 13.42,20.41 14.19,21.17 R47.2 17.57,21.59 C35.+ | C35.+ 21.59,21.59 | C35.+ 21.54,22.17 21.54,34.14 21.54,35.76 21.54,40.23 | 21.54,55.07 21.54,55.68 17.07,60.15 v17.07,62.18 17.07,67.53 C4.1 19.27,69.66 19.41,69.81 IC4.8 | v21.13,55.07 21.54,55.07 | 21.54,55.07 21.54,40.23 | C42.1 58.45,48.62 IC8.5 61.11,48.62 62.18,47.55 | 52.45,58.93 58.34,58.93 C40.1 60.22,61.32 IC7.5 60.55,61.37 63.8,61.37 64.66,60.52 C39.1 65.73,59.44 v66.24,58.93 | 52.45,58.93 46.84,58.93 C24.1 | IC6.4 52.45,58.93 | C24.1 46.84,59.33 | v24.28,55.07 34.95,55.07 39.62,55.07 43.28,58.73 46.24,58.73 C24.1 | U2.P6 8.31,45.29 8.94,45.92 11.38,45.92 17.07,40.23 21.54,40.23 | 62.18,47.55 v62.99,47.55 | C41.1 62.18,47.1 62.18,47.55
  Bottom 0.406: v11.79,64.41 14.02,62.18 v17.07,62.18 | v24.38,35.76 v21.13,35.76 | v22.35,19.51 23.57,19.51 v25.2,21.13
  Bottom 0.61: v24.28,55.07 v21.13,55.07 | v62.99,47.55 66.24,50.8 v66.24,58.93
V-  (via drill 0.4, 0.6)
  Top 0.406: IC1.4 10.16,63.52 10.58,63.1 C6.1 | C1.2 20.59,66.65 24.38,66.65 24.92,66.12 IC4.4 | IC8.TH@2 IC8.TH@1 | IC7.TH@2 IC7.TH@1 | 39.01,54.05 38.89,54.05 IC5.4 38.89,51.17 C23.2 | 23.27,38.2 30.85,38.2 IC2.4 31.01,40.07 C21.2 | U2.P5 7.04,42.14 9.35,39.83 13.41,39.83 13.82,39.42 13.82,39.22 | 40.64,15.85 40.97,16.18 IC3.11 40.97,19.14 C3.2 | 40.64,15.85 35.36,15.85 34.95,16.26 34.95,18.29 30.89,22.35 23.98,22.35 | U$4.6 18.8,6.6 19.16,6.24 | U1.P5 11.48,35.87 13.82,38.2 13.82,39.22 | v23.77,39.22 23.27,39.22 | v19.81,39.22 13.82,39.22 | 40.64,15.85 41.45,15.04 42.67,15.04 43.48,15.85 48.77,15.85 51.71,12.9 U3.P5 | v58.93,10.97 59.61,10.29 U4.P5 59.61,9.75 C50.2 | v52.83,14.63 52.15,13.95 U3.P5 | U3.P5 52.15,11.14 C48.2
  Top 0.61: C34.2 19.16,6.24 R49.2 | 23.27,54.05 23.27,39.22 23.27,38.2 23.27,24.69 23.98,23.98 23.98,22.35 23.98,13.99 C36.- | C6.1 10.58,57.49 11.18,56.9 v18.69,56.9 | 19.1,65.17 C1.2 18.69,64.76 18.69,60.96 23.27,56.39 | IC7.1 60.4,67.87 | 60.4,67.87 60.96,67.87 61.23,68.14 | 52.45,57.71 58.34,57.71 C45.1 60.22,55.42 IC8.1 60.56,55.47 62.99,55.47 | 52.45,57.71 46.84,57.71 | IC6.11 52.45,57.71 | 46.84,57.71 C25.2 | 62.99,55.47 64.62,55.47 | 64.62,55.47 70.69,55.47 | 70.69,55.47 IC8.TH@2 | C46.1 64.62,57.3 64.62,55.47 | IC8.3 62.99,52.02 62.99,55.47 | 70.69,55.47 IC7.TH@2 62.69,64.72 | 62.69,64.72 IC7.3 | 60.4,67.87 60.71,68.17 61.81,68.17 | 61.81,68.17 62.69,68.17 62.69,64.72 | C44.1 61.81,68.17 | 60.4,67.87 58.3,67.87 C43.1 | 46.84,57.71 43.89,57.71 40.23,54.05 39.01,54.05 23.27,54.05 | 23.27,56.39 23.27,54.05 | 23.27,56.39 23.27,56.79 v23.57,57.1
  Top 1.016: C36.- 25.4,12.7 19.81,12.7 18.8,11.68 U$4.6
  Bottom 0.406: v19.81,39.22 v23.77,39.22 | v58.93,10.97 56.49,10.97 v52.83,14.63
  Bottom 0.61: v18.69,56.9 23.37,56.9 v23.57,57.1

### Text on the board
Top: VSTiBox | mixer v1.0
tNames: Lin- | GND | Lin+ | Rin+ | MON IN / HEADPHONE OUT | GND | Rin- | Rout- | GND | Rout+ | IN1 | Lout+ | GND | Lout- | IN2 | V+ | GND | MIX OUT | V-
tRestrict: VSTiBox | v1.0